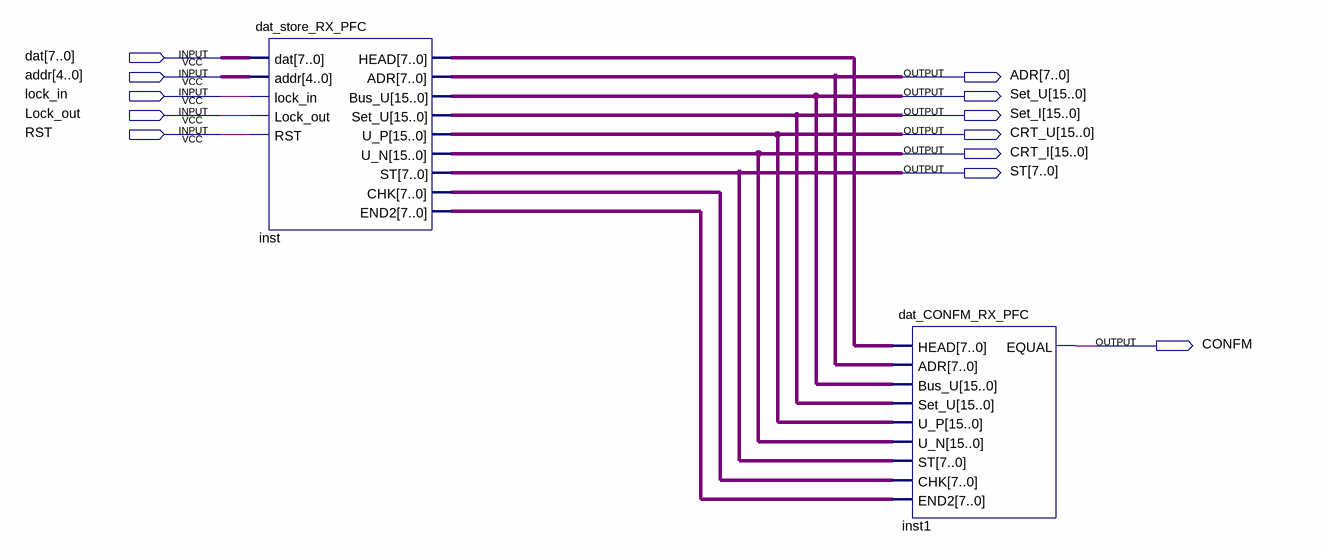
[diagram p0: schematic sheet]
// Quartus schematic RCV_DEAL_PFC.bdf as structural Verilog: 2 symbols, 12 pins
module RCV_DEAL_PFC (
  input  [7:0] dat,
  input  [4:0] addr,
  input  lock_in,
  input  Lock_out,
  input  RST,
  output [7:0] ADR,
  output [15:0] Set_U,
  output [15:0] Set_I,
  output [15:0] CRT_U,
  output [15:0] CRT_I,
  output [7:0] ST,
  output CONFM
);

  wire [7:0] inst_chk, inst_end2, inst_head;

  dat_store_RX_PFC inst (
    .dat(dat), .addr(addr), .lock_in(lock_in), .Lock_out(Lock_out), .RST(RST), .HEAD(inst_head), .ADR(ADR),
    .Bus_U(Set_U), .Set_U(Set_I), .U_P(CRT_U), .U_N(CRT_I), .ST(ST), .CHK(inst_chk), .END2(inst_end2));
  dat_CONFM_RX_PFC inst1 (
    .HEAD(inst_head), .ADR(ADR), .Bus_U(Set_U), .Set_U(Set_I), .U_P(CRT_U), .U_N(CRT_I), .ST(ST),
    .CHK(inst_chk), .END2(inst_end2), .EQUAL(CONFM));
endmodule
